# EAGLE design abpf (EAGLE 9.6.2)
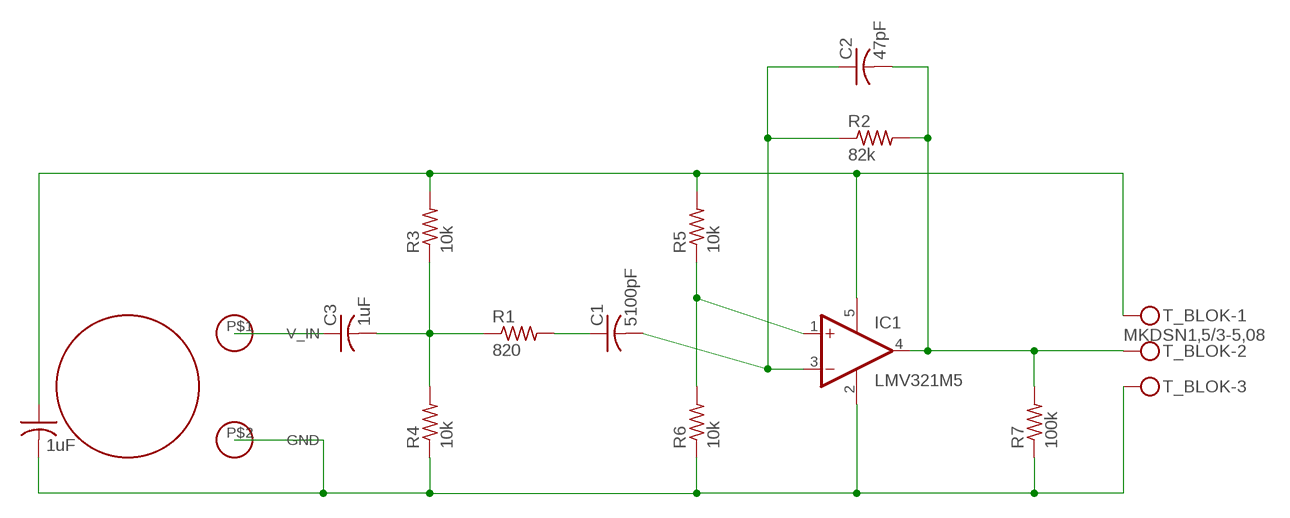
[diagram p0: schematic, sheet 1]

## Parts
C1  5100pF  C-USC0805  [C0805]
C2  47pF  C-USC0805  [C0805]
C3  1uF  C-USC0805  [C0805]
C4  1uF  C-USC0805  [C0805]
IC1  LMV321M5  [SOT23-5]
R1  820  R-US_R0805  [R0805]
R2  82k  R-US_R0805  [R0805]
R3  10k  R-US_R0805  [R0805]
R4  10k  R-US_R0805  [R0805]
R5  10k  R-US_R0805  [R0805]
R6  10k  R-US_R0805  [R0805]
R7  100k  R-US_R0805  [R0805]
T_BLOK  MKDSN1,5/3-5,08  [MKDSN1,5/3-5,08]
U$1  10MM_USONIC  [10MM_USONIC]

## Nets
GND: C4.2 IC1.2(V-) R4.1 R6.1 R7.1 T_BLOK.3 U$1.P$2(GND)
N$1: C3.2 R1.1 R3.1 R4.2
N$2: C1.1 R1.2
N$4: IC1.1(+IN) R5.1 R6.2
N$5: C2.2 IC1.4(OUT) R2.2 R7.2 T_BLOK.2
N$7: C4.1 IC1.5(V+) R3.2 R5.2 T_BLOK.1
N$8: C3.1 U$1.P$1(V_IN)
N$9: C1.2 C2.1 IC1.3(-IN) R2.1

## Library data of the parts
C1-C4 = rcl:C-US: CAPACITOR, American symbol; SPICEPREFIX: C
IC1 = linear:LMV321?*: General Purpose, Low Voltage, Rail-to-Rail Output Operational Amplifiers Source: http://www.national.com/mpf/LM/LMV321.html http://www.national.com/dt/lmv_qual.pdf
R1-R7 = rcl:R-US_: RESISTOR, American symbol; SPICEPREFIX: R
T_BLOK = con-phoenix-508:MKDSN1,5/3-5,08: MKDSN 1,5/ 3-5,08 Printklemme Nennstrom: 13,5 A Nennspannung: 250 V Rastermaß: 5,08 mm Polzahl: 3 Anschlussart: Schraubanschluss Montage: Löten Anschlussrichtung Leiter/Platine: 0 ° Artikelnummer: 1729131 Source: http://eshop.phoenixcontact.com .. 1729131.pdf
U$1 = ultrasonic:10MM_USONIC: 10mm ultrasonic

## Board
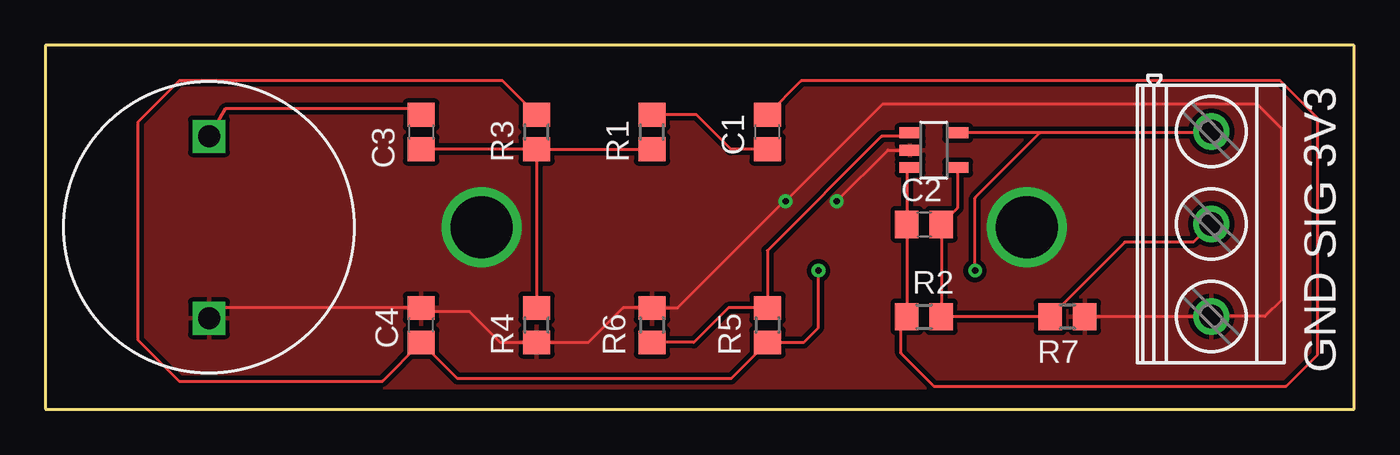
[diagram p1: board, top side]
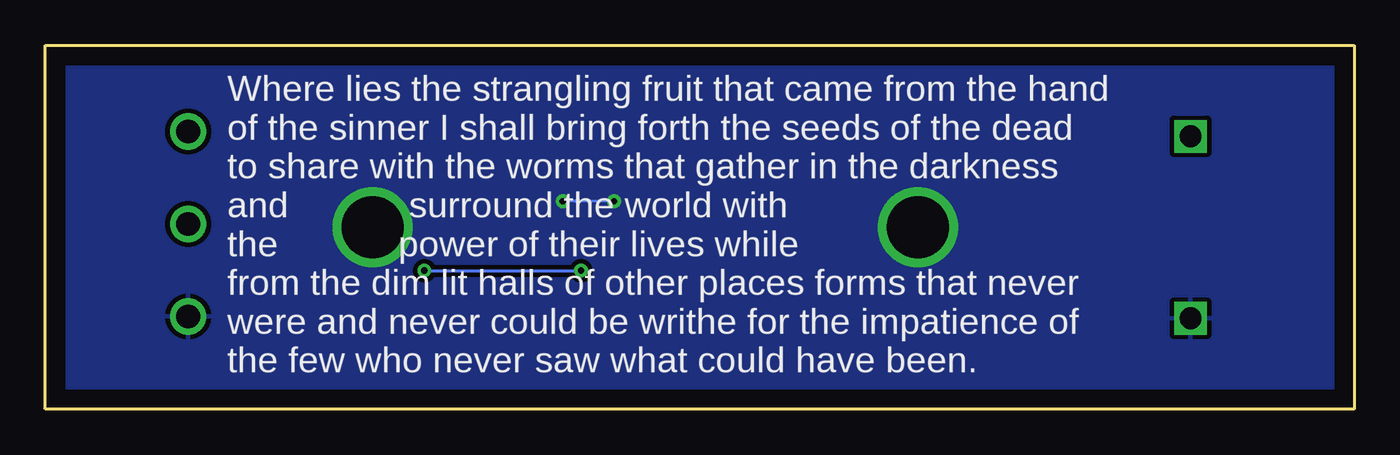
[diagram p2: board, bottom side, seen from below]

Size 72 x 20 mm. Coordinates in mm from the lower left corner, seen from the top.
Outline: 0,0 72,0 72,20 0,20 0,0
Copper layers (1*16): Top 0.035mm / dielectric 1.5mm / Bottom 0.035mm
Design rules "default": minimum track width 6mil, minimum drill 0.35mm, track to track 6mil, track to pad 6mil, pad to pad 6mil, via to via 6mil, smd to smd 6mil, copper to edge 40mil, drill to drill 6mil, minimum pad ring 10mil, minimum via ring 8mil, stop-mask expansion 4mil, vias tented up to drill 0mil, thermal gap 10mil

### Footprints (pad centres in the part's own frame; a part is rotated, then mirrored left to right if it is on the bottom)
C0805 = smd 1.3 x 1.5: 1 -0.95,0; 2 0.95,0
SOT23-5 = smd 0.6 x 1.2: 1 -0.95,-1.306; 2 0,-1.306; 3 0.95,-1.306; 4 0.95,1.306; 5 -0.95,1.306
R0805 = smd 1.3 x 1.5: 1 -0.95,0; 2 0.95,0
MKDSN1,5/3-5,08 = drill 1.3 pad 2: 1 -7.641,0.025; 2 -2.561,0.025; 3 2.519,0.025
10MM_USONIC = drill 1.2 square: P$1 0,0; P$2 0,10

### Placement (x,y rotation side)
C1  39.72,15.24 90 top
C2  48.34,10.16 0 top
C3  20.67,15.24 270 top
C4  20.67,4.62 90 top
IC1  48.88,14.24 270 top
R1  33.37,15.24 90 top
R2  48.34,5.08 0 top
R3  27.02,15.24 90 top
R4  27.02,4.62 90 top
R5  39.72,4.62 270 top
R6  33.37,4.62 270 top
R7  56.23,5.08 180 top
T_BLOK  64.12,7.62 270 top
U$1  9,15 180 top

### Tracks (layer width: path | path; a pad name or v marks a point on that pad's centre or on a via)
GND  (via drill 0.35, 3.4)
  Top 0.152: R7.1 64.12,5.08 T_BLOK.3 67.1,5.1 68,6 68,13 68,15 68,15.44 66.66,16.78 46.07,16.78 v40.72,11.43 40.64,11.43 34.78,5.57 R6.1 31.78,5.57 29.88,3.67 R4.1 25.02,3.67 23.34,5.35 20.89,5.35 C4.2 8.95,5.57 U$1.P$2 | v43.53,11.43 46.34,14.24 IC1.2
  Bottom 0.152: v40.72,11.43 v43.53,11.43
  other vias: 24,10 54,10
  pour Top (isolate 0.254): 1,19 71,19 71,1 1,1
  pour Bottom (isolate 0.254): 1,19 71,19 71,1 1,1
N$1
  Top 0.152: R3.1 C3.2 | R3.1 R4.2 | R3.1 R1.1
N$2
  Top 0.152: C1.1 37.71,14.29 35.81,16.19 R1.2
N$4
  Top 0.152: R6.2 35.67,3.67 37.57,5.57 R5.1 39.72,8.72 46,15 47.38,15 IC1.1
N$5
  Top 0.152: IC1.4 50.19,11.06 C2.2 R2.2 R7.2 59.38,9.18 63.15,9.18 T_BLOK.2
N$7  (via drill 0.35)
  Top 0.152: T_BLOK.1 64.07,15.19 54.72,15.19 | 54.72,15.19 IC1.5 | 54.72,15.19 51.15,11.62 v51.15,7.62 | R3.2 25.16,18.05 7.35,18.05 5.08,15.78 5.08,3.81 7.35,1.54 18.54,1.54 C4.1 22.67,1.67 37.72,1.67 R5.2 41.72,3.67 42.53,4.48 v42.53,7.62
  Bottom 0.152: v51.15,7.62 v42.53,7.62
N$8
  Top 0.152: C3.1 20.35,16.51 9.89,16.51 U$1.P$1
N$9
  Top 0.152: IC1.3 47.39,13.11 C2.1 R2.1 47.16,4.84 47.08,4.76 47.08,3.08 48.88,1.27 68.27,1.27 70,3 70,16 67.95,18.05 41.58,18.05 C1.2

### Text on the board
bPlace: Where lies the strangling fruit that came from the hand / of the sinner I shall bring forth the seeds of the dead / to share with the worms that gather in the darkness / and surround the world with / the power of their lives while / from the dim lit halls of other places forms that never / were and never could be writhe for the impatience of / the few who never saw what could have been.
tNames: GND SIG 3V3